# Altium schematic sheet 恒流.SchDoc
size A3
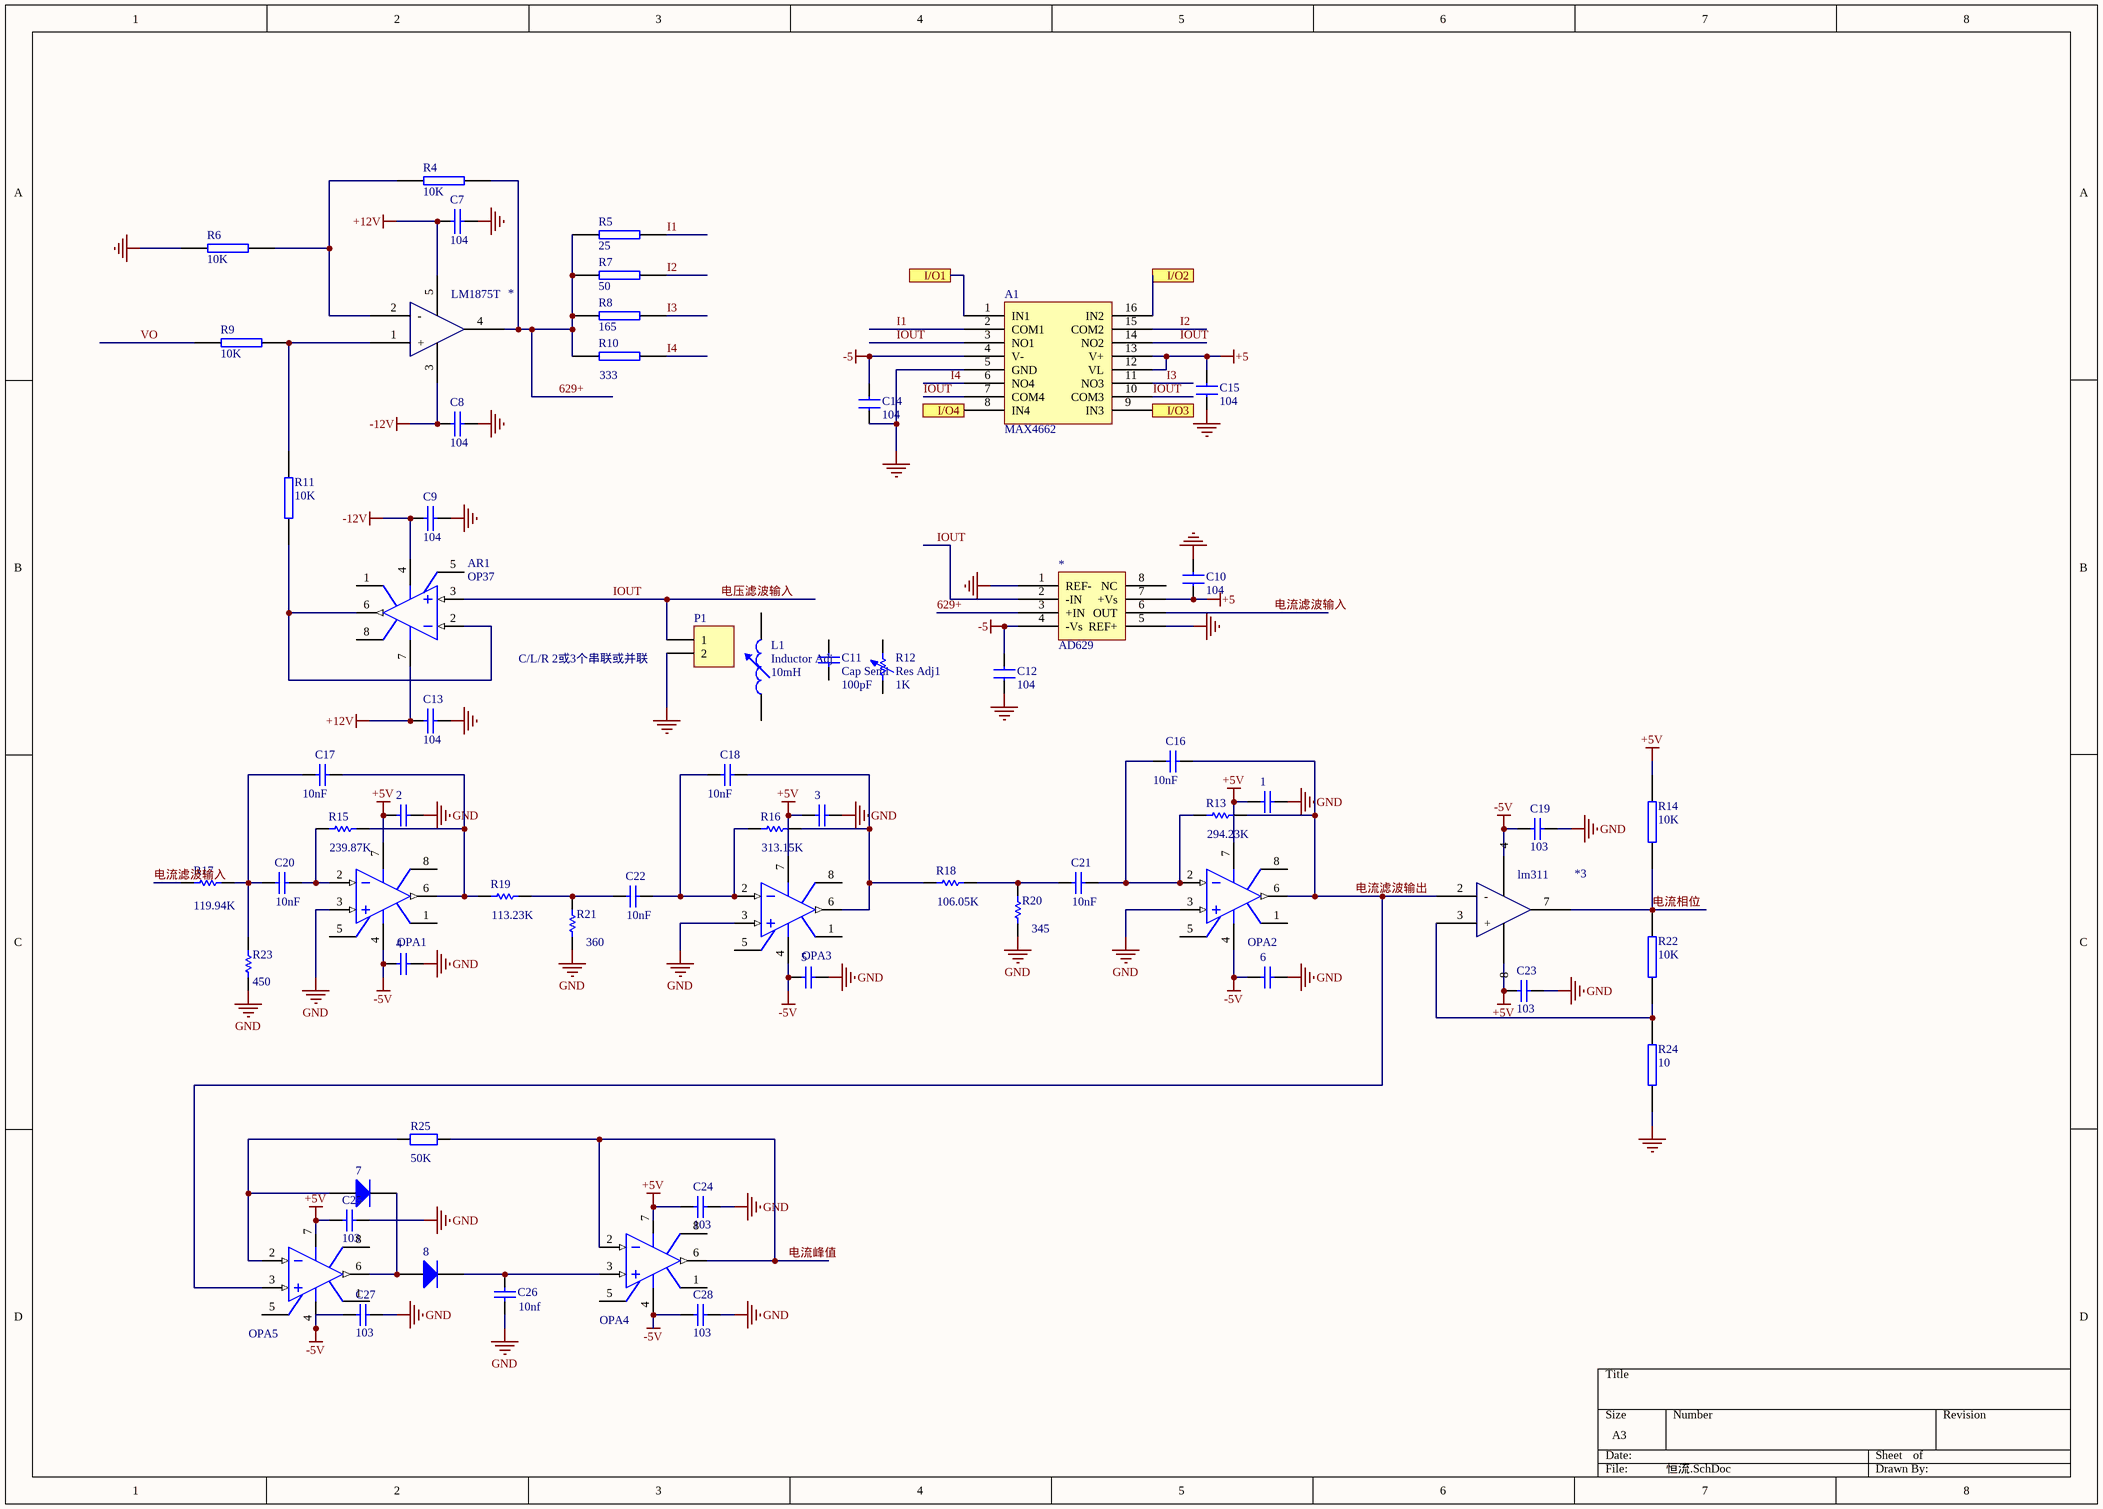
[diagram p0: 恒流.SchDoc]

## Parts
(Parts that share a designator on the sheet are numbered #1, #2 ... from top to bottom, then left to right.)
1  Cap  [RAD-0.3]  (value not drawn)
2  Cap  [RAD-0.3]  (value not drawn)
3  Cap  [RAD-0.3]  (value not drawn)
4  Cap  [RAD-0.3]  (value not drawn)
5  Cap  [RAD-0.3]  (value not drawn)
6  Cap  [RAD-0.3]  (value not drawn)
7  Diode 1N4001  [DO-41]  (value not drawn)
8  Diode 1N4001  [DO-41]  (value not drawn)
*3  lm311
*#1  LM1875T
*#2  AD629
A1  MAX4662
AR1  OP37  [H-08A]
C7  104
C8  104
C9  104
C10  104  [RAD0.1]
C11  Cap Semi  value 100pF  [C1206]
C12  104  [RAD0.1]
C13  104
C14  104  [RAD0.1]
C15  104  [RAD0.1]
C16  value 10nF  [RAD-0.3]  (hidden comment: Cap)
C17  value 10nF  [RAD-0.3]  (hidden comment: Cap)
C18  value 10nF  [RAD-0.3]  (hidden comment: Cap)
C19  value 103  [RAD-0.3]  (hidden comment: Cap)
C20  value 10nF  [RAD-0.3]  (hidden comment: Cap)
C21  value 10nF  [RAD-0.3]  (hidden comment: Cap)
C22  value 10nF  [RAD-0.3]  (hidden comment: Cap)
C23  value 103  [RAD-0.3]  (hidden comment: Cap)
C24  value 103  [RAD-0.3]  (hidden comment: Cap)
C25  value 103  [RAD-0.3]  (hidden comment: Cap)
C26  value 10nf  [RAD-0.3]  (hidden comment: Cap)
C27  value 103  [RAD-0.3]  (hidden comment: Cap)
C28  value 103  [RAD-0.3]  (hidden comment: Cap)
L1  Inductor Adj  value 10mH  [AXIAL-0.8]
OPA1  Op Amp  [H-08A]  (value not drawn)
OPA2  Op Amp  [H-08A]  (value not drawn)
OPA3  Op Amp  [H-08A]  (value not drawn)
OPA4  Op Amp  [H-08A]  (value not drawn)
OPA5  Op Amp  [H-08A]  (value not drawn)
P1  C/L/R 2或3个串联或并联  [HDR1X2H]
R4  10K
R5  25
R6  10K
R7  50
R8  165
R9  10K
R10  333  [AXIAL0.3]
R11  10K
R12  Res Adj1  value 1K  [AXIAL-0.7]
R13  value 294.23K  [AXIAL-0.3]  (hidden comment: Res1)
R14  10K
R15  value 239.87K  [AXIAL-0.3]  (hidden comment: Res1)
R16  value 313.15K  [AXIAL-0.3]  (hidden comment: Res1)
R17  value 119.94K  [AXIAL-0.3]  (hidden comment: Res1)
R18  value 106.05K  [AXIAL-0.3]  (hidden comment: Res1)
R19  value 113.23K  [AXIAL-0.3]  (hidden comment: Res1)
R20  value 345  [AXIAL-0.3]  (hidden comment: Res1)
R21  value 360  [AXIAL-0.3]  (hidden comment: Res1)
R22  10K
R23  value 450  [AXIAL-0.3]  (hidden comment: Res1)
R24  10
R25  value 50K  [AXIAL-0.4]  (hidden comment: Res2)

## Ports
I/O1, I/O2, I/O3, I/O4

## Nets
+5: *#2.7(+Vs) A1.12(VL) A1.13(V+) C10.1 C15.1
+5V: 1.1 2.1 3.1 C23.2 C24.2 C25.2 OPA1.7(V+) OPA2.7(V+) OPA3.7(V+) OPA4.7(V+) OPA5.7(V+) R14.2
+12V: AR1.7(V+) C7.1 C13.1
-5: *#2.4(-Vs) A1.4(V-) C12.1 C14.2
-5V: 4.1 5.1 6.1 C19.2 C27.2 C28.2 OPA1.4(V-) OPA2.4(V-) OPA3.4(V-) OPA4.4(V-) OPA5.4(V-)
-12V: AR1.4(V-) C8.1 C9.1
GND: 1.2 2.2 3.2 4.2 5.2 6.2 A1.5(GND) C7.2 C8.2 C9.2 C10.2 C12.2 C13.2 C14.1 C15.2 C19.1 C23.1 C24.1 C25.1 C26.2 C27.1 C28.1 OPA1.3(IN+) OPA2.3(IN+) OPA3.3(IN+) R6.2 R20.1 R21.1 R23.1 R24.1
Net*#2_1: *#2.1(REF-) *#2.5(REF+) P1.2
629+: *#1.4 *#2.3(+IN) R4.2 R5.1 R7.1 R8.1 R10.2
I1: A1.2(COM1) R5.2
I2: A1.15(COM2) R7.2
I3: A1.11(NO3) R8.2
I4: A1.6(NO4) R10.1
I/O1: A1.1(IN1) ; port I/O1
I/O2: A1.16(IN2) ; port I/O2
I/O3: A1.9(IN3) ; port I/O3
I/O4: A1.8(IN4) ; port I/O4
IOUT: *#2.2(-IN) A1.3(NO1) A1.7(COM4) A1.10(COM3) A1.14(NO2) AR1.3(IN+) P1.1  [also labelled 电压滤波输入]
VO: R9.1
电流峰值: OPA4.2(IN-) OPA4.6(OUT) R25.2
电流滤波输入: *#2.6(OUT) R17.1
电流滤波输出: *3.2(-) C16.2 OPA2.6(OUT) OPA5.3(IN+) R13.2
电流相位: *3.7 R14.1 R22.2
Net7_1: 7.1(A) OPA5.2(IN-) R25.1
Net7_2: 7.2(K) 8.1(A) OPA5.6(OUT)
Net8_2: 8.2(K) C26.1 OPA4.3(IN+)
Net*3_3: *3.3(+) R22.1 R24.2
Net*#1_1: *#1.1(+) R9.2 R11.1
Net*#1_2: *#1.2(-) R4.1 R6.1
NetAR1_2: AR1.2(IN-) AR1.6(OUT) R11.2
NetC16_1: C16.1 C21.2 OPA2.2(IN-) R13.1
NetC17_1: C17.1 C20.1 R17.2 R23.2
NetC17_2: C17.2 OPA1.6(OUT) R15.2 R19.1
NetC18_1: C18.1 C22.2 OPA3.2(IN-) R16.1
NetC18_2: C18.2 OPA3.6(OUT) R16.2 R18.1
NetC20_2: C20.2 OPA1.2(IN-) R15.1
NetC21_1: C21.1 R18.2 R20.2
NetC22_1: C22.1 R19.2 R21.2

Not connected (* = marked no-connect by the designer): *3 ?1(4) ?2(8); *#1 3 5; *#2 8(NC); AR1 1(OS_NUL) 5(OS_NUL) 8(TAB); C11 1 2; L1 1 2; OPA1 1(OS_NUL) 5(OS_NUL) 8(TAB); OPA2 1(OS_NUL) 5(OS_NUL) 8(TAB); OPA3 1(OS_NUL) 5(OS_NUL) 8(TAB); OPA4 1(OS_NUL) 5(OS_NUL) 8(TAB); OPA5 1(OS_NUL) 5(OS_NUL) 8(TAB); R12 1 2

## Library data of the parts
1-6 = Cap: Capacitor; Value: 100pF; Published: 8-Jun-2000; LatestRevisionDate: 17-Jul-2002; LatestRevisionNote: Re-released for DXP Platform.; PackageReference: RAD-0.3; Publisher: Altium Limited; PackageDescription: Radial Cap, Thru-Hole; 2 Leads; 0.3 in Pin Spacing
7 8 = Diode 1N4001: 1 Amp General Purpose Rectifier; Published: 8-Jun-2000; LatestRevisionDate: 17-Jul-2002; LatestRevisionNote: Re-released for DXP Platform.; DatasheetVersion: 1998; PackageVersion: Aug-1999; PackageReference: DO-41; Publisher: Altium Limited; PackageDescription: Diode, Axial; Body 5.2 x 2.7 mm (LxDia. max), Lead Dia. 0.86 mm (max); Code_JEDEC: DO-204-AL; ComponentLink1Description: Manufacturer Link; ComponentLink1URL: http://www.fairchildsemi.com/; ComponentLink2Description: Datasheet; ComponentLink2URL: http://www.fairchildsemi.com/ds/1N%2F1N4001.pdf
A1 = MAX2662
AR1 OPA1-OPA5 = Op Amp: FET Operational Amplifier; Published: 8-Jun-2000; LatestRevisionDate: 17-Jul-2002; LatestRevisionNote: Re-released for DXP Platform.; DatasheetVersion: REV. B; PackageVersion: 1990; PackageReference: H-08A; Publisher: Altium Limited; PackageDescription: Can; 8 Leads; Pin Circle Dia. 5.08 mm; Lead Dia. 0.53 mm (max); ComponentLink1Description: Manufacturer Link; ComponentLink1URL: http://www.analog.com/
C7-C10 C12-C15 = CAP: Capacitor
  C10 C12 C14 C15: Value: 104
C11 = Cap Semi: Capacitor (Semiconductor SIM Model); Published: 8-Jun-2000; LatestRevisionDate: 29-May-2009; LatestRevisionNote: IPC-7351 Footprint Added.; PackageReference: C1206; Publisher: Altium Limited; PackageDescription: Chip Capacitor
C16-C28 = Cap: Capacitor; Published: 8-Jun-2000; LatestRevisionDate: 17-Jul-2002; LatestRevisionNote: Re-released for DXP Platform.; PackageReference: RAD-0.3; Publisher: Altium Limited; PackageDescription: Radial Cap, Thru-Hole; 2 Leads; 0.3 in Pin Spacing
L1 = Inductor Adj: Adjustable Inductor; Set Position: 0.5; Published: 24-Mar-1999; LatestRevisionDate: 17-Jul-2002; LatestRevisionNote: Re-released for DXP Platform.; PackageReference: AXIAL-0.8; Publisher: Altium Limited; PackageDescription: Axial Device, Thru-Hole; 2 Leads; 0.8 in Pin Spacing
P1 = Header 2H: Header, 2-Pin, Right Angle; LatestRevisionDate: 17-Jul-2002; LatestRevisionNote: Re-released for DXP Platform.; Publisher: Altium Limited
R4-R11 R14 R22 R24 = RES2
R12 = Res Adj1: Variable Resistor; Set Position: 0.5; Published: 8-Jun-2000; LatestRevisionDate: 17-Jul-2002; LatestRevisionNote: Re-released for DXP Platform.; PackageReference: AXIAL-0.7; Publisher: Altium Limited; PackageDescription: Axial Device, Thru-Hole; 2 Leads; 0.7 in Pin Spacing
R13 R15-R21 R23 = Res1: Resistor; Published: 8-Jun-2000; LatestRevisionDate: 17-Jul-2002; LatestRevisionNote: Re-released for DXP Platform.; PackageReference: AXIAL-0.3; Publisher: Altium Limited; PackageDescription: Axial Device, Thru-Hole; 2 Leads; 0.3 in Pin Spacing
R25 = Res2: Resistor; Published: 8-Jun-2000; LatestRevisionDate: 17-Jul-2002; LatestRevisionNote: Re-released for DXP Platform.; PackageReference: AXIAL-0.4; Publisher: Altium Limited; PackageDescription: Axial Device, Thru-Hole; 2 Leads; 0.4 in Pin Spacing